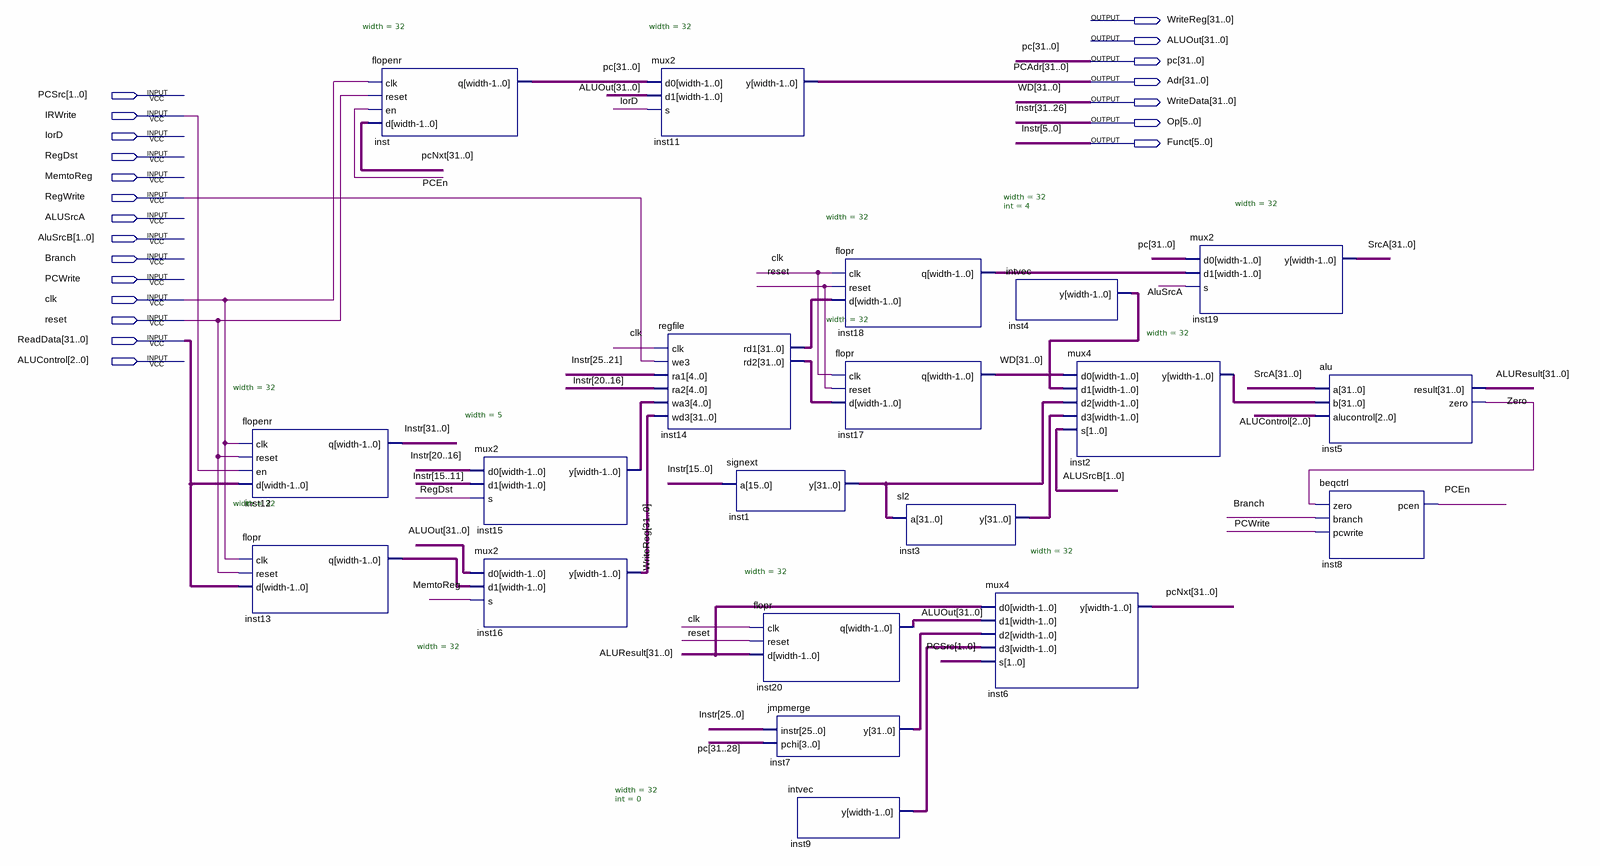
[diagram p0: schematic sheet]
// Quartus schematic datapath.bdf as structural Verilog: 20 symbols, 21 pins
module datapath (
  input  [1:0] PCSrc,
  input  IRWrite,
  input  IorD,
  input  RegDst,
  input  MemtoReg,
  input  RegWrite,
  input  ALUSrcA,
  input  [1:0] AluSrcB,
  input  Branch,
  input  PCWrite,
  input  clk,
  input  reset,
  input  [31:0] ReadData,
  input  [2:0] ALUControl,
  output [31:0] WriteReg,
  output [31:0] ALUOut,
  output [31:0] pc,
  output [31:0] Adr,
  output [31:0] WriteData,
  output [5:0] Op,
  output [5:0] Funct
);

  wire PCEn, Zero;
  wire [4:0] inst15_y;
  wire [25:6] Instr;
  wire [31:0] ALUResult, inst1_y, inst2_y, inst3_y, inst4_y, inst7_y, inst9_y, inst13_q, inst14_rd1,
       inst14_rd2, inst18_q, pcNxt, SrcA;

  flopenr #(.width(32)) inst12 (.clk(clk), .reset(reset), .en(IRWrite), .d(ReadData), .q({Op, Instr, Funct}));
  flopr #(.width(32)) inst13 (.clk(clk), .reset(reset), .d(ReadData), .q(inst13_q));
  flopenr #(.width(32)) inst (.clk(clk), .reset(reset), .en(PCEn), .d(pcNxt), .q(pc));
  mux2 #(.width(5)) inst15 (.d0(Instr[20:16]), .d1(Instr[15:11]), .s(RegDst), .y(inst15_y));
  mux2 #(.width(32)) inst16 (.d0(ALUOut), .d1(inst13_q), .s(MemtoReg), .y(WriteReg));
  mux2 #(.width(32)) inst11 (.d0(pc), .d1(ALUOut), .s(IorD), .y(Adr));
  regfile inst14 (
    .clk(clk), .we3(RegWrite), .ra1(Instr[25:21]), .ra2(Instr[20:16]), .wa3(inst15_y), .wd3(WriteReg),
    .rd1(inst14_rd1), .rd2(inst14_rd2));
  signext inst1 (.a({Instr[15:6], Funct}), .y(inst1_y));
  flopr #(.width(32)) inst20 (.clk(clk), .reset(reset), .d(ALUResult), .q(ALUOut));
  jmpmerge inst7 (.instr({Instr, Funct}), .pchi(pc[31:28]), .y(inst7_y));
  intvec #(.width(32), .\int (0)) inst9 (.y(inst9_y));
  flopr #(.width(32)) inst18 (.clk(clk), .reset(reset), .d(inst14_rd1), .q(inst18_q));
  flopr #(.width(32)) inst17 (.clk(clk), .reset(reset), .d(inst14_rd2), .q(WriteData));
  sl2 inst3 (.a(inst1_y), .y(inst3_y));
  intvec #(.width(32), .\int (4)) inst4 (.y(inst4_y));
  mux4 #(.width(32)) inst6 (.d0(ALUResult), .d1(ALUOut), .d2(inst7_y), .d3(inst9_y), .s(PCSrc), .y(pcNxt));
  mux4 #(.width(32)) inst2 (.d0(WriteData), .d1(inst4_y), .d2(inst1_y), .d3(inst3_y), .s(AluSrcB), .y(inst2_y));
  mux2 #(.width(32)) inst19 (.d0(pc), .d1(inst18_q), .s(ALUSrcA), .y(SrcA));
  alu inst5 (.a(SrcA), .b(inst2_y), .alucontrol(ALUControl), .result(ALUResult), .zero(Zero));
  beqctrl inst8 (.zero(Zero), .branch(Branch), .pcwrite(PCWrite), .pcen(PCEn));

  // Other names for the same wires on the sheet: Instr (some bits) = {Op, Funct}; PCAdr[31:0] = Adr;
  //   WD[31:0] = WriteData
endmodule
